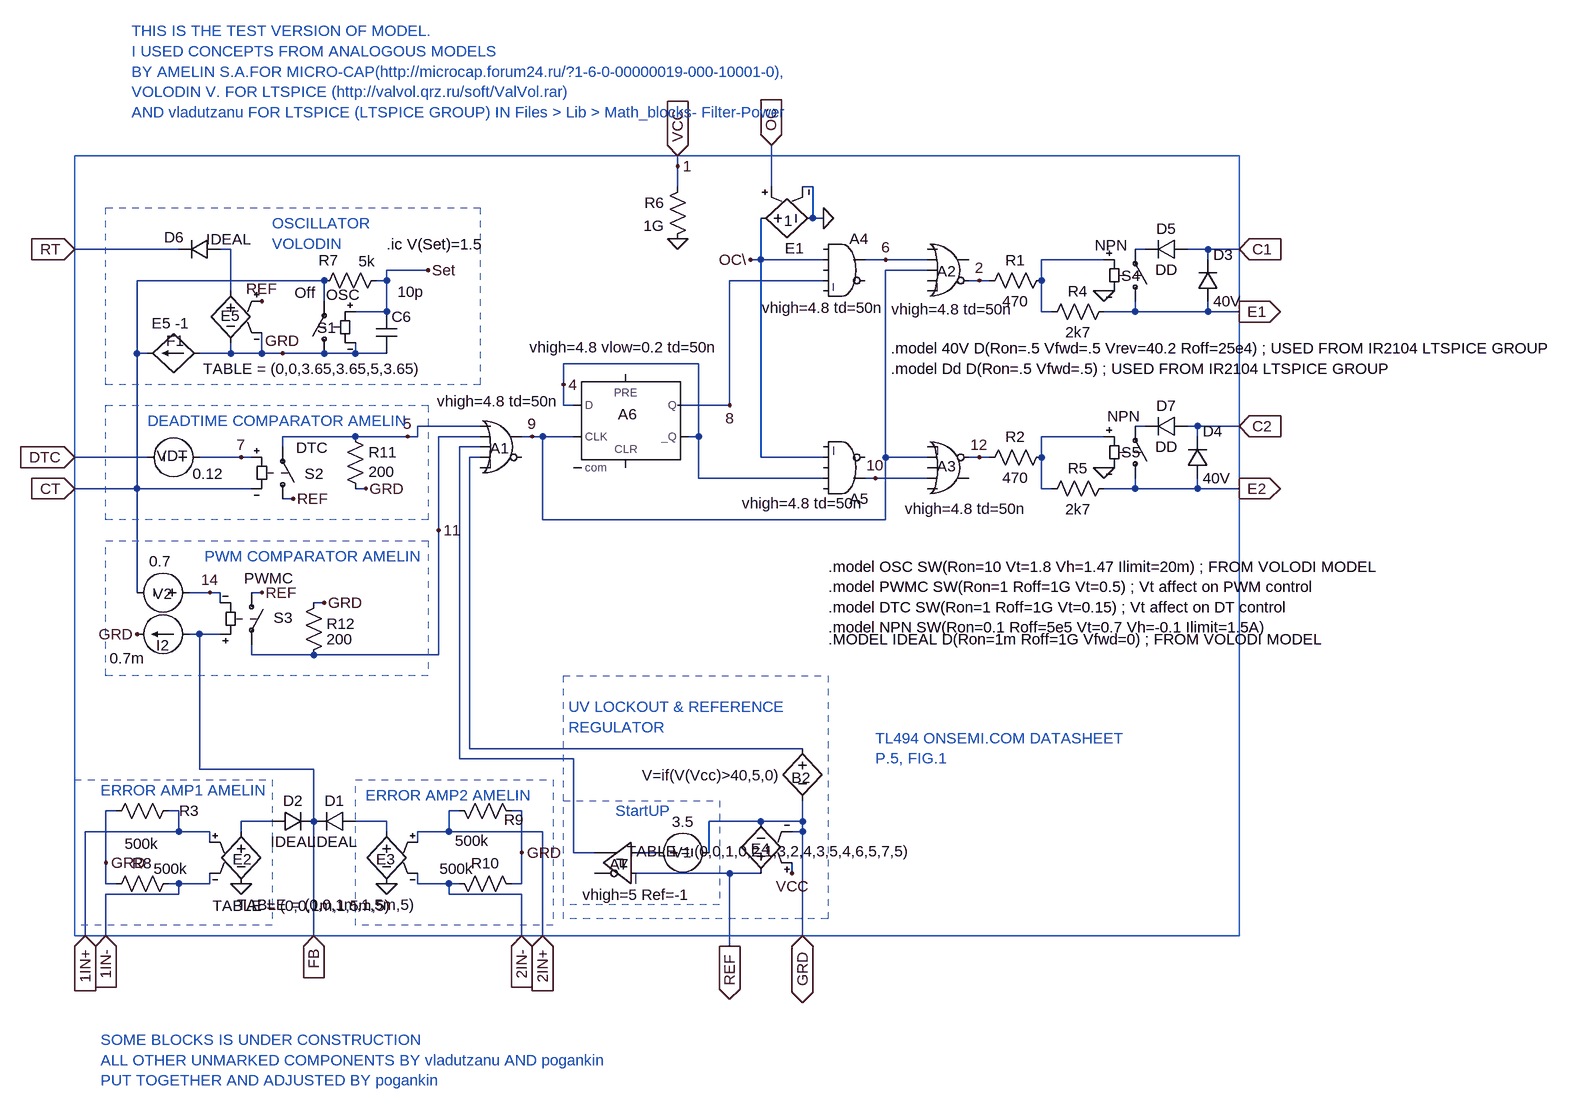
[diagram p0: schematic TL494H.asc]
TL494H.asc, the LTspice schematic file:
Version 4.1
SHEET 1 4392 2032
WIRE 1232 288 1232 272
WIRE 1232 320 1232 288
WIRE 1376 320 1376 256
WIRE 1440 320 1424 320
WIRE 1440 368 1440 320
WIRE 1456 368 1440 368
WIRE 464 416 304 416
WIRE 544 416 528 416
WIRE 1952 416 1936 416
WIRE 2048 416 2016 416
WIRE 2096 416 2048 416
WIRE 1360 432 1360 368
WIRE 1360 432 1344 432
WIRE 1456 432 1360 432
WIRE 1552 432 1520 432
WIRE 1616 432 1552 432
WIRE 1888 432 1792 432
WIRE 2048 432 2048 416
WIRE 848 448 784 448
WIRE 1616 448 1552 448
WIRE 688 464 400 464
WIRE 784 464 784 448
WIRE 784 464 768 464
WIRE 1456 464 1312 464
WIRE 1696 464 1680 464
WIRE 1712 464 1696 464
WIRE 1792 464 1792 432
WIRE 544 480 544 416
WIRE 688 496 688 464
WIRE 784 512 784 464
WIRE 784 512 736 512
WIRE 1792 512 1792 464
WIRE 1808 512 1792 512
WIRE 1936 512 1936 496
WIRE 1936 512 1888 512
WIRE 2048 512 2048 496
WIRE 2048 512 1936 512
WIRE 2096 512 2048 512
WIRE 400 576 400 464
WIRE 416 576 400 576
WIRE 544 576 544 560
WIRE 544 576 496 576
WIRE 592 576 592 544
WIRE 592 576 544 576
WIRE 624 576 592 576
WIRE 688 576 624 576
WIRE 736 576 736 560
WIRE 736 576 688 576
WIRE 784 576 736 576
WIRE 1264 592 1056 592
WIRE 1056 624 1056 592
WIRE 1056 656 1056 624
WIRE 1072 656 1056 656
WIRE 1312 656 1312 464
WIRE 1312 656 1232 656
WIRE 928 688 832 688
WIRE 1952 688 1936 688
WIRE 2032 688 2016 688
WIRE 2096 688 2032 688
WIRE 736 704 624 704
WIRE 816 704 736 704
WIRE 832 704 832 688
WIRE 832 704 816 704
WIRE 928 704 864 704
WIRE 1008 704 992 704
WIRE 1024 704 1008 704
WIRE 1072 704 1024 704
WIRE 1264 704 1264 592
WIRE 1264 704 1248 704
WIRE 1888 704 1792 704
WIRE 2032 704 2032 688
WIRE 624 720 624 704
WIRE 928 720 896 720
WIRE 416 736 304 736
WIRE 560 736 496 736
WIRE 576 736 560 736
WIRE 928 736 912 736
WIRE 1360 736 1360 432
WIRE 1456 736 1360 736
WIRE 1552 736 1552 448
WIRE 1616 736 1552 736
WIRE 1696 736 1680 736
WIRE 1712 736 1696 736
WIRE 1792 736 1792 704
WIRE 1264 768 1264 704
WIRE 1456 768 1264 768
WIRE 1536 768 1520 768
WIRE 1616 768 1536 768
WIRE 400 784 400 576
WIRE 400 784 304 784
WIRE 576 784 400 784
WIRE 752 784 736 784
WIRE 1792 784 1792 736
WIRE 1808 784 1792 784
WIRE 1936 784 1936 768
WIRE 1936 784 1888 784
WIRE 2032 784 2032 768
WIRE 2032 784 1936 784
WIRE 2096 784 2032 784
WIRE 640 800 624 800
WIRE 1024 832 1024 704
WIRE 1552 832 1552 736
WIRE 1552 832 1024 832
WIRE 864 848 864 704
WIRE 400 944 400 784
WIRE 512 944 480 944
WIRE 528 944 512 944
WIRE 592 944 576 944
WIRE 528 960 528 944
WIRE 688 960 672 960
WIRE 496 1008 480 1008
WIRE 528 1008 496 1008
WIRE 576 1040 576 1024
WIRE 672 1040 576 1040
WIRE 864 1040 864 848
WIRE 864 1040 672 1040
WIRE 912 1184 912 736
WIRE 1424 1184 912 1184
WIRE 896 1200 896 720
WIRE 1072 1200 896 1200
WIRE 496 1216 496 1008
WIRE 672 1216 496 1216
WIRE 368 1280 352 1280
WIRE 464 1280 448 1280
WIRE 896 1280 880 1280
WIRE 992 1280 976 1280
WIRE 608 1296 560 1296
WIRE 672 1296 672 1216
WIRE 784 1296 736 1296
WIRE 1360 1296 1280 1296
WIRE 1424 1296 1424 1264
WIRE 1424 1296 1360 1296
WIRE 464 1312 464 1280
WIRE 464 1312 320 1312
WIRE 512 1312 464 1312
WIRE 560 1312 560 1296
WIRE 784 1312 784 1296
WIRE 880 1312 880 1280
WIRE 880 1312 832 1312
WIRE 1024 1312 880 1312
WIRE 1424 1312 1424 1296
WIRE 1424 1312 1408 1312
WIRE 512 1328 512 1312
WIRE 832 1328 832 1312
WIRE 992 1344 992 1280
WIRE 1072 1344 1072 1200
WIRE 1104 1344 1072 1344
WIRE 1200 1344 1168 1344
WIRE 1280 1344 1280 1296
WIRE 352 1360 352 1280
WIRE 1312 1376 1168 1376
WIRE 1360 1376 1312 1376
WIRE 1408 1376 1408 1360
WIRE 352 1392 352 1360
WIRE 368 1392 352 1392
WIRE 464 1392 448 1392
WIRE 512 1392 512 1376
WIRE 512 1392 464 1392
WIRE 832 1392 832 1376
WIRE 880 1392 832 1392
WIRE 896 1392 880 1392
WIRE 992 1392 992 1344
WIRE 992 1392 976 1392
WIRE 464 1408 464 1392
WIRE 464 1408 352 1408
WIRE 880 1408 880 1392
WIRE 992 1408 880 1408
WIRE 320 1472 320 1312
WIRE 352 1472 352 1408
WIRE 672 1472 672 1296
WIRE 992 1472 992 1408
WIRE 1024 1472 1024 1312
WIRE 1424 1472 1424 1312
WIRE 1312 1488 1312 1376
FLAG 1008 704 9
FLAG 1696 464 2
FLAG 1696 736 12
FLAG 1552 432 6
FLAG 1344 432 OC\
FLAG 1536 768 10
FLAG 1376 256 OC
IOPIN 1376 256 In
FLAG 1456 368 0
FLAG 1056 624 4
FLAG 1312 656 8
FLAG 672 1472 FB
IOPIN 672 1472 In
FLAG 624 576 GRD
FLAG 1232 400 0
FLAG 2096 416 C1
IOPIN 2096 416 In
FLAG 2096 512 E1
IOPIN 2096 512 Out
FLAG 2096 688 C2
IOPIN 2096 688 In
FLAG 2096 784 E2
IOPIN 2096 784 Out
FLAG 1312 1488 REF
IOPIN 1312 1488 Out
FLAG 1232 272 VCC
IOPIN 1232 272 In
FLAG 1232 288 1
FLAG 304 736 DTC
IOPIN 304 736 In
FLAG 560 736 7
FLAG 304 784 CT
IOPIN 304 784 In
FLAG 816 704 5
FLAG 400 1008 GRD
FLAG 512 944 14
FLAG 864 848 11
FLAG 1024 1472 2IN+
IOPIN 1024 1472 In
FLAG 992 1472 2IN-
IOPIN 992 1472 In
FLAG 304 416 RT
IOPIN 304 416 In
FLAG 1424 1472 GRD
IOPIN 1424 1472 BiDir
FLAG 848 448 Set
FLAG 320 1472 1IN+
IOPIN 320 1472 In
FLAG 352 1472 1IN-
IOPIN 352 1472 In
FLAG 560 1392 0
FLAG 784 1392 0
FLAG 640 800 REF
FLAG 752 784 GRD
FLAG 592 944 REF
FLAG 688 960 GRD
FLAG 1888 480 0
FLAG 1888 752 0
FLAG 352 1360 GRD
FLAG 992 1344 GRD
FLAG 1408 1376 VCC
FLAG 592 496 REF
SYMBOL Digital\\or 960 656 R0
WINDOW 0 -17 66 Left 0
WINDOW 3 -98 -6 Left 0
SYMATTR InstName A1
SYMATTR Value vhigh=4.8 td=50n
SYMBOL Digital\\or 1648 384 R0
WINDOW 0 -17 66 Left 0
WINDOW 3 -87 124 Left 0
SYMATTR InstName A2
SYMATTR Value vhigh=4.8 td=50n
SYMBOL Digital\\or 1648 816 M180
WINDOW 0 -17 66 Left 0
WINDOW 3 -66 1 Left 0
SYMATTR InstName A3
SYMATTR Value vhigh=4.8 td=50n
SYMBOL Digital\\and 1488 384 R0
WINDOW 3 -126 122 Left 0
SYMATTR Value vhigh=4.8 td=50n
SYMATTR InstName A4
SYMBOL Digital\\and 1488 816 M180
WINDOW 3 -157 9 Left 0
SYMATTR Value vhigh=4.8 td=50n
SYMATTR InstName A5
SYMBOL e 1344 368 M90
WINDOW 0 46 82 VLeft 0
WINDOW 3 4 65 VLeft 0
SYMATTR InstName E1
SYMATTR Value 1
SYMBOL Digital\\dflop 1152 608 R0
WINDOW 0 -12 62 Left 0
WINDOW 3 -148 -41 Left 0
SYMATTR InstName A6
SYMATTR Value vhigh=4.8 vlow=0.2 td=50n
SYMBOL current 480 1008 R90
WINDOW 123 0 0 Left 0
WINDOW 39 0 0 Left 0
WINDOW 0 17 51 VLeft 0
WINDOW 3 37 122 VLeft 0
SYMATTR InstName I2
SYMATTR Value 0.7m
SYMBOL res 1808 448 R90
WINDOW 0 0 56 VBottom 0
WINDOW 3 32 56 VTop 0
SYMATTR InstName R1
SYMATTR Value 470
SYMBOL res 1808 720 R90
WINDOW 0 0 56 VBottom 0
WINDOW 3 32 56 VTop 0
SYMATTR InstName R2
SYMATTR Value 470
SYMBOL sw 688 592 R180
WINDOW 0 -18 55 Left 0
WINDOW 3 -55 106 Left 0
WINDOW 123 13 109 Left 0
SYMATTR InstName S1
SYMATTR Value OSC
SYMATTR Value2 Off
SYMBOL res 1248 304 M0
SYMATTR InstName R6
SYMATTR Value 1G
SYMBOL diode 736 1280 R90
WINDOW 0 0 32 VBottom 0
WINDOW 3 32 32 VTop 0
SYMATTR InstName D1
SYMATTR Value IDEAL
SYMBOL diode 608 1280 M90
WINDOW 0 0 32 VBottom 0
WINDOW 3 32 32 VTop 0
SYMATTR InstName D2
SYMATTR Value IDEAL
SYMBOL voltage 512 736 M270
WINDOW 0 -13 58 VTop 0
WINDOW 3 -10 3 VBottom 0
SYMATTR InstName VDT
SYMATTR Value 0.12
SYMBOL voltage 496 944 R90
WINDOW 123 0 0 Left 0
WINDOW 39 0 0 Left 0
WINDOW 0 2 42 VRight 0
WINDOW 3 -48 44 VRight 0
SYMATTR InstName V2
SYMATTR Value 0.7
SYMBOL cap 768 512 R0
WINDOW 3 33 -31 Left 0
SYMATTR Value 10p
SYMATTR InstName C6
SYMBOL res 784 448 R90
WINDOW 0 0 89 VBottom 0
WINDOW 3 -29 30 VTop 0
SYMATTR InstName R7
SYMATTR Value 5k
SYMBOL diode 528 400 R90
WINDOW 0 13 71 VBottom 0
WINDOW 3 -15 -13 VTop 0
SYMATTR InstName D6
SYMATTR Value IDEAL
SYMBOL f 496 576 R90
WINDOW 0 -4 37 VBottom 0
WINDOW 3 -62 45 VTop 0
SYMATTR InstName F1
SYMATTR Value E5 -1
SYMBOL bv 1424 1168 M0
WINDOW 0 -12 61 Left 0
WINDOW 3 35 57 Left 0
SYMATTR InstName B2
SYMATTR Value V=if(V(Vcc)>40,5,0)
SYMBOL res 464 1264 R90
WINDOW 0 31 -16 VBottom 0
WINDOW 3 51 57 VTop 0
SYMATTR InstName R3
SYMATTR Value 500k
SYMBOL res 464 1376 R90
WINDOW 0 0 56 VBottom 0
WINDOW 3 -23 12 VTop 0
SYMATTR InstName R8
SYMATTR Value 500k
SYMBOL e 560 1296 R0
WINDOW 0 -13 58 Left 0
WINDOW 3 -44 130 Left 0
SYMATTR InstName E2
SYMATTR Value TABLE = (0,0,1m,1,5m,5)
SYMBOL res 880 1264 M90
WINDOW 0 45 100 VBottom 0
WINDOW 3 46 36 VTop 0
SYMATTR InstName R9
SYMATTR Value 500k
SYMBOL res 880 1376 M90
WINDOW 0 0 56 VBottom 0
WINDOW 3 -23 12 VTop 0
SYMATTR InstName R10
SYMATTR Value 500k
SYMBOL e 784 1296 M0
WINDOW 0 -13 58 Left 0
WINDOW 3 -45 128 Left 0
SYMATTR InstName E3
SYMATTR Value TABLE = (0,0,1m,1,5m,5)
SYMBOL sw 624 816 M180
WINDOW 0 34 55 Left 0
WINDOW 3 21 95 Left 0
SYMATTR InstName S2
SYMATTR Value DTC
SYMBOL res 720 688 R0
WINDOW 3 36 70 Left 0
SYMATTR Value 200
SYMATTR InstName R11
SYMBOL sw 576 928 R0
WINDOW 0 34 55 Left 0
WINDOW 3 -11 -6 Left 0
SYMATTR InstName S3
SYMATTR Value PWMC
SYMBOL res 656 1056 M180
WINDOW 0 36 64 Left 0
WINDOW 3 36 40 Left 0
SYMATTR InstName R12
SYMATTR Value 200
SYMBOL sw 1936 512 M180
WINDOW 0 -21 55 Left 0
WINDOW 3 -62 102 Left 0
WINDOW 39 -131 105 Left 0
SYMATTR InstName S4
SYMATTR Value NPN
SYMBOL sw 1936 784 M180
WINDOW 0 -21 56 Left 0
WINDOW 3 -43 111 Left 0
WINDOW 39 -122 101 Left 0
SYMATTR InstName S5
SYMATTR Value NPN
SYMBOL res 1792 528 R270
WINDOW 0 32 56 VTop 0
WINDOW 3 0 56 VBottom 0
SYMATTR InstName R4
SYMATTR Value 2k7
SYMBOL res 1792 800 R270
WINDOW 0 32 56 VTop 0
WINDOW 3 0 56 VBottom 0
SYMATTR InstName R5
SYMATTR Value 2k7
SYMBOL diode 2032 496 M180
WINDOW 0 24 72 Left 0
WINDOW 3 24 0 Left 0
SYMATTR InstName D3
SYMATTR Value 40V
SYMBOL diode 2016 768 M180
WINDOW 0 24 72 Left 0
WINDOW 3 24 0 Left 0
SYMATTR InstName D4
SYMATTR Value 40V
SYMBOL diode 2016 400 R90
WINDOW 0 0 32 VBottom 0
WINDOW 3 32 32 VTop 0
SYMATTR InstName D5
SYMATTR Value DD
SYMBOL diode 2016 672 R90
WINDOW 0 0 32 VBottom 0
WINDOW 3 32 32 VTop 0
SYMATTR InstName D7
SYMATTR Value DD
SYMBOL e 1360 1392 R180
WINDOW 0 -14 54 Left 0
WINDOW 3 -231 50 Left 0
SYMATTR InstName E4
SYMATTR Value TABLE = (0,0,1,0,2,1,3,2,4,3,5,4,6,5,7,5)
SYMBOL e 544 464 M0
WINDOW 0 -14 54 Left 0
WINDOW 3 -294 136 Left 0
SYMATTR InstName E5
SYMATTR Value TABLE = (0,0,3.65,3.65,5,3.65)
SYMBOL Digital\\diffschmitt 1168 1296 M0
WINDOW 0 12 66 Left 0
WINDOW 3 -83 113 Left 0
SYMATTR InstName A7
SYMATTR Value vhigh=5 Ref=-1
SYMBOL voltage 1184 1344 R270
WINDOW 0 16 55 VBottom 0
WINDOW 3 32 56 VTop 0
WINDOW 123 0 0 Left 0
WINDOW 39 0 0 Left 0
SYMATTR InstName V1
SYMATTR Value 3.5
TEXT 1464 1016 Left 0 !.MODEL IDEAL D(Ron=1m Roff=1G Vfwd=0) ; FROM VOLODI MODEL
TEXT 784 408 Left 0 !.ic V(Set)=1.5
TEXT 1464 904 Left 0 !.model OSC SW(Ron=10 Vt=1.8 Vh=1.47 Ilimit=20m) ; FROM VOLODI MODEL\n.model PWMC SW(Ron=1 Roff=1G Vt=0.5) ; Vt affect on PWM control\n.model DTC SW(Ron=1 Roff=1G Vt=0.15) ; Vt affect on DT control\n.model NPN SW(Ron=0.1 Roff=5e5 Vt=0.7 Vh=-0.1 Ilimit=1.5A)
TEXT 608 376 Left 0 ;OSCILLATOR\nVOLODIN
TEXT 416 680 Left 0 ;DEADTIME COMPARATOR AMELIN
TEXT 504 888 Left 0 ;PWM COMPARATOR AMELIN
TEXT 344 1248 Left 0 ;ERROR AMP1 AMELIN
TEXT 752 1256 Left 0 ;ERROR AMP2 AMELIN
TEXT 1064 1120 Left 0 ;UV LOCKOUT & REFERENCE\nREGULATOR
TEXT 1536 1168 Left 0 ;TL494 ONSEMI.COM DATASHEET\nP.5, FIG.1
TEXT 1560 568 Left 0 !.model 40V D(Ron=.5 Vfwd=.5 Vrev=40.2 Roff=25e4) ; USED FROM IR2104 LTSPICE GROUP
TEXT 1560 600 Left 0 !.model Dd D(Ron=.5 Vfwd=.5) ; USED FROM IR2104 LTSPICE GROUP
TEXT 1136 1280 Left 0 ;StartUP
TEXT 392 80 Left 0 ;THIS IS THE TEST VERSION OF MODEL.\nI USED CONCEPTS FROM ANALOGOUS MODELS\nBY AMELIN S.A.FOR MICRO-CAP(http://microcap.forum24.ru/?1-6-0-00000019-000-10001-0),\nVOLODIN V. FOR LTSPICE (http://valvol.qrz.ru/soft/ValVol.rar) \nAND vladutzanu FOR LTSPICE (LTSPICE GROUP) IN Files > Lib > Math_blocks- Filter-Power
TEXT 344 1632 Left 0 ;SOME BLOCKS IS UNDER CONSTRUCTION\nALL OTHER UNMARKED COMPONENTS BY vladutzanu AND pogankin\nPUT TOGETHER AND ADJUSTED BY pogankin
RECTANGLE Normal 2096 272 304 1472
RECTANGLE Normal 928 624 352 352 2
RECTANGLE Normal 848 832 352 656 2
RECTANGLE Normal 848 1072 352 864 2
RECTANGLE Normal 608 1456 304 1232 2
RECTANGLE Normal 1040 1456 736 1232 2
RECTANGLE Normal 1463 1446 1056 1072 2
RECTANGLE Normal 1296 1424 1056 1264 2

The netlist it stands for:
* TL494H.asc
A1 5 11 N006 N007 0 0 9 0 OR vhigh=4.8 td=50n
A2 0 6 9 0 0 2 0 0 OR vhigh=4.8 td=50n
A3 0 10 0 9 0 12 0 0 OR vhigh=4.8 td=50n
A4 0 OC\ 0 8 0 0 6 0 AND vhigh=4.8 td=50n
A5 0 4 0 OC\ 0 0 10 0 AND vhigh=4.8 td=50n
E1 OC\ 0 OC 0 1
A6 4 0 9 0 0 4 8 0 DFLOP vhigh=4.8 vlow=0.2 td=50n
I2 FB GRD 0.7m
R1 N003 2 470
R2 N005 12 470
S1 GRD CT Set GRD OSC Off
R6 1 0 1G
D1 N009 FB IDEAL
D2 N008 FB IDEAL
VDT 7 DTC 0.12
V2 14 CT 0.7
C6 Set GRD 10p
R7 Set CT 5k
D6 N001 RT IDEAL
F1 GRD CT E5 -1
B2 N007 GRD V=if(V(Vcc)>40,5,0)
R3 1IN+ GRD 500k
R8 1IN- GRD 500k
E2 N008 0 1IN+ 1IN- TABLE = (0,0,1m,1,5m,5)
R9 2IN+ GRD 500k
R10 2IN- GRD 500k
E3 N009 0 2IN+ 2IN- TABLE = (0,0,1m,1,5m,5)
S2 REF 5 7 CT DTC
R11 5 GRD 200
S3 REF 11 FB 14 PWMC
R12 11 GRD 200
S4 E1 N002 N003 0 NPN
S5 E2 N004 N005 0 NPN
R4 N003 E1 2k7
R5 N005 E2 2k7
D3 E1 C1 40V
D4 E2 C2 40V
D5 C1 N002 DD
D7 C2 N004 DD
E4 REF GRD 1 GRD TABLE = (0,0,1,0,2,1,3,2,4,3,5,4,6,5,7,5)
E5 N001 GRD REF GRD TABLE = (0,0,3.65,3.65,5,3.65)
A7 N010 REF 0 0 0 0 N006 0 SCHMITT vhigh=5 Ref=-1
V1 N010 GRD 3.5
.model D D
.lib standard.dio
.MODEL IDEAL D(Ron=1m Roff=1G Vfwd=0) ; FROM VOLODI MODEL
.ic V(Set)=1.5
.model OSC SW(Ron=10 Vt=1.8 Vh=1.47 Ilimit=20m) ; FROM VOLODI MODEL
.model PWMC SW(Ron=1 Roff=1G Vt=0.5) ; Vt affect on PWM control
.model DTC SW(Ron=1 Roff=1G Vt=0.15) ; Vt affect on DT control
.model NPN SW(Ron=0.1 Roff=5e5 Vt=0.7 Vh=-0.1 Ilimit=1.5A)
* OSCILLATOR
* VOLODIN
* DEADTIME COMPARATOR AMELIN
* PWM COMPARATOR AMELIN
* ERROR AMP1 AMELIN
* ERROR AMP2 AMELIN
* UV LOCKOUT & REFERENCE
* REGULATOR
* TL494 ONSEMI.COM DATASHEET
* P.5, FIG.1
.model 40V D(Ron=.5 Vfwd=.5 Vrev=40.2 Roff=25e4) ; USED FROM IR2104 LTSPICE GROUP
.model Dd D(Ron=.5 Vfwd=.5) ; USED FROM IR2104 LTSPICE GROUP
* StartUP
* THIS IS THE TEST VERSION OF MODEL.
* I USED CONCEPTS FROM ANALOGOUS MODELS
* BY AMELIN S.A.FOR MICRO-CAP(http://microcap.forum24.ru/?1-6-0-00000019-000-10001-0),
* VOLODIN V. FOR LTSPICE (http://valvol.qrz.ru/soft/ValVol.rar)
* AND vladutzanu FOR LTSPICE (LTSPICE GROUP) IN Files > Lib > Math_blocks- Filter-Power
* SOME BLOCKS IS UNDER CONSTRUCTION
* ALL OTHER UNMARKED COMPONENTS BY vladutzanu AND pogankin
* PUT TOGETHER AND ADJUSTED BY pogankin
.backanno
.end